# EAGLE schematic main (EAGLE 6.5.0)
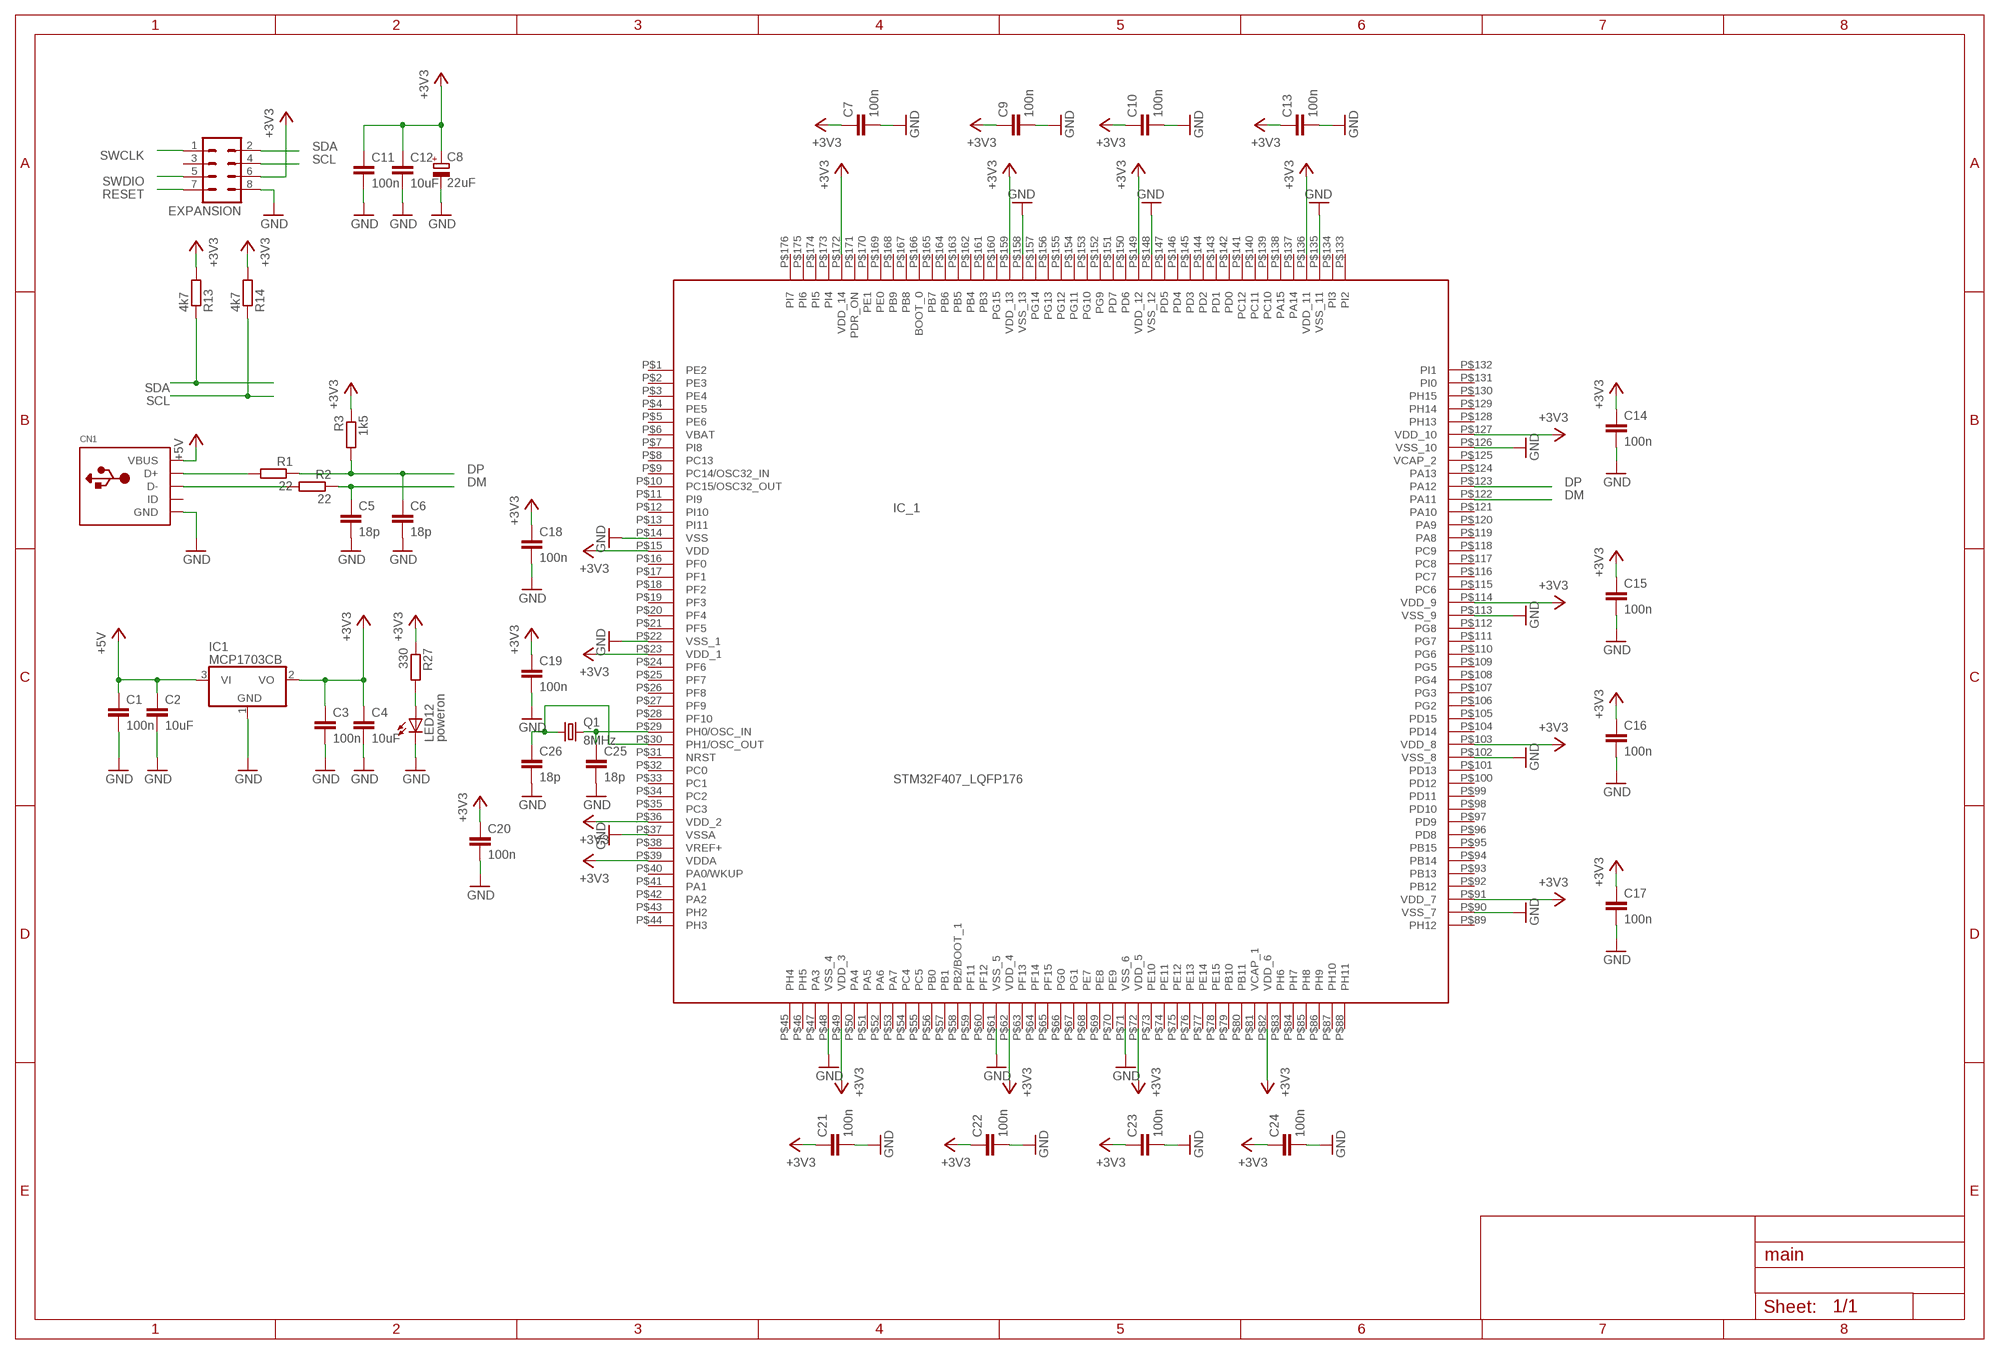
[diagram p0: schematic, sheet 1]

## Parts
C1  100n  C-EUC0805  [C0805]
C2  10uF  C-EUC0805  [C0805]
C3  100n  C-EUC0805  [C0805]
C4  10uF  C-EUC0805  [C0805]
C5  18p  C-EUC0805  [C0805]
C6  18p  C-EUC0805  [C0805]
C7  100n  C-EUC0805  [C0805]
C8  22uF  CPOL-EU153CLV-0505  [153CLV-0505]
C9  100n  C-EUC0805  [C0805]
C10  100n  C-EUC0805  [C0805]
C11  100n  C-EUC0805  [C0805]
C12  10uF  C-EUC0805  [C0805]
C13  100n  C-EUC0805  [C0805]
C14  100n  C-EUC0805  [C0805]
C15  100n  C-EUC0805  [C0805]
C16  100n  C-EUC0805  [C0805]
C17  100n  C-EUC0805  [C0805]
C18  100n  C-EUC0805  [C0805]
C19  100n  C-EUC0805  [C0805]
C20  100n  C-EUC0805  [C0805]
C21  100n  C-EUC0805  [C0805]
C22  100n  C-EUC0805  [C0805]
C23  100n  C-EUC0805  [C0805]
C24  100n  C-EUC0805  [C0805]
C25  18p  C-EUC0805  [C0805]
C26  18p  C-EUC0805  [C0805]
CN1  USBMINIB  [USB-MINIB]
EXPANSION  MA04-2  [MA04-2]
IC1  MCP1703CB  [SOT23]
IC_1  STM32F407_LQFP176  [STM32F407_LQFP176]
LED12  poweron  LEDCHIPLED_1206  [CHIPLED_1206]
Q1  8MHz  CRYSTALCTS406  [CTS406]
R1  22  R-EU_M0805  [M0805]
R2  22  R-EU_M0805  [M0805]
R3  1k5  R-EU_M0805  [M0805]
R13  4k7  R-EU_M0805  [M0805]
R14  4k7  R-EU_M0805  [M0805]
R27  330  R-EU_M0805  [M0805]

## Nets
+3V3: C3.1 C4.1 C7.1 C8.+ C9.1 C10.1 C11.1 C12.1 C13.1 C14.1 C15.1 C16.1 C17.1 C18.1 C19.1 C20.1 C21.1 C22.1 C23.1 C24.1 EXPANSION.6 IC1.2(VO) IC_1.P$15(VDD) IC_1.P$23(VDD_1) IC_1.P$36(VDD_2) IC_1.P$39(VDDA) IC_1.P$49(VDD_3) IC_1.P$62(VDD_4) IC_1.P$72(VDD_5) IC_1.P$82(VDD_6) IC_1.P$91(VDD_7) IC_1.P$103(VDD_8) IC_1.P$114(VDD_9) IC_1.P$127(VDD_10) IC_1.P$136(VDD_11) IC_1.P$149(VDD_12) IC_1.P$159(VDD_13) IC_1.P$172(VDD_14) R3.1 R13.2 R14.2 R27.1
+5V: C1.1 C2.1 CN1.VBUS IC1.3(VI)
DM: C5.1 IC_1.P$122(PA11) R2.1
DP: C6.1 IC_1.P$123(PA12) R1.1 R3.2
GND: C1.2 C2.2 C3.2 C4.2 C5.2 C6.2 C7.2 C8.- C9.2 C10.2 C11.2 C12.2 C13.2 C14.2 C15.2 C16.2 C17.2 C18.2 C19.2 C20.2 C21.2 C22.2 C23.2 C24.2 C25.2 C26.2 CN1.GND EXPANSION.8 IC1.1(GND) IC_1.P$14(VSS) IC_1.P$22(VSS_1) IC_1.P$37(VSSA) IC_1.P$48(VSS_4) IC_1.P$61(VSS_5) IC_1.P$71(VSS_6) IC_1.P$90(VSS_7) IC_1.P$102(VSS_8) IC_1.P$113(VSS_9) IC_1.P$126(VSS_10) IC_1.P$135(VSS_11) IC_1.P$148(VSS_12) IC_1.P$158(VSS_13) LED12.C
N$1: CN1.D+ R1.2
N$2: CN1.D- R2.2
N$3: C25.1 IC_1.P$29(PH0/OSC_IN) Q1.3
N$4: C26.1 IC_1.P$30(PH1/OSC_OUT) Q1.1
N$23: LED12.A R27.2
RESET: EXPANSION.7
SCL: EXPANSION.4 R14.1
SDA: EXPANSION.2 R13.1
SWCLK: EXPANSION.1
SWDIO: EXPANSION.5
Unconnected: CN1.ID EXPANSION.3 IC_1.P$1(PE2) IC_1.P$2(PE3) IC_1.P$3(PE4) IC_1.P$4(PE5) IC_1.P$5(PE6) IC_1.P$7(PI8) IC_1.P$8(PC13) IC_1.P$9(PC14/OSC32_IN) IC_1.P$10(PC15/OSC32_OUT) IC_1.P$11(PI9) IC_1.P$12(PI10) IC_1.P$13(PI11) IC_1.P$16(PF0) IC_1.P$17(PF1) IC_1.P$18(PF2) IC_1.P$19(PF3) IC_1.P$20(PF4) IC_1.P$21(PF5) IC_1.P$24(PF6) IC_1.P$25(PF7) IC_1.P$26(PF8) IC_1.P$27(PF9) IC_1.P$28(PF10) IC_1.P$31(NRST) IC_1.P$32(PC0) IC_1.P$33(PC1) IC_1.P$34(PC2) IC_1.P$35(PC3) IC_1.P$40(PA0/WKUP) IC_1.P$41(PA1) IC_1.P$42(PA2) IC_1.P$43(PH2) IC_1.P$44(PH3) IC_1.P$45(PH4) IC_1.P$46(PH5) IC_1.P$47(PA3) IC_1.P$50(PA4) IC_1.P$51(PA5) IC_1.P$52(PA6) IC_1.P$53(PA7) IC_1.P$54(PC4) IC_1.P$55(PC5) IC_1.P$56(PB0) IC_1.P$57(PB1) IC_1.P$58(PB2/BOOT_1) IC_1.P$59(PF11) IC_1.P$60(PF12) IC_1.P$63(PF13) IC_1.P$64(PF14) IC_1.P$65(PF15) IC_1.P$66(PG0) IC_1.P$67(PG1) IC_1.P$68(PE7) IC_1.P$69(PE8) IC_1.P$70(PE9) IC_1.P$73(PE10) IC_1.P$74(PE11) IC_1.P$75(PE12) IC_1.P$76(PE13) IC_1.P$77(PE14) IC_1.P$78(PE15) IC_1.P$79(PB10) IC_1.P$80(PB11) IC_1.P$83(PH6) IC_1.P$84(PH7) IC_1.P$85(PH8) IC_1.P$86(PH9) IC_1.P$87(PH10) IC_1.P$88(PH11) IC_1.P$89(PH12) IC_1.P$92(PB12) IC_1.P$93(PB13) IC_1.P$94(PB14) IC_1.P$95(PB15) IC_1.P$96(PD8) IC_1.P$97(PD9) IC_1.P$98(PD10) IC_1.P$99(PD11) IC_1.P$100(PD12) IC_1.P$101(PD13) IC_1.P$104(PD14) IC_1.P$105(PD15) IC_1.P$106(PG2) IC_1.P$107(PG3) IC_1.P$108(PG4) IC_1.P$109(PG5) IC_1.P$110(PG6) IC_1.P$111(PG7) IC_1.P$112(PG8) IC_1.P$115(PC6) IC_1.P$116(PC7) IC_1.P$117(PC8) IC_1.P$118(PC9) IC_1.P$119(PA8) IC_1.P$120(PA9) IC_1.P$121(PA10) IC_1.P$124(PA13) IC_1.P$128(PH13) IC_1.P$129(PH14) IC_1.P$130(PH15) IC_1.P$131(PI0) IC_1.P$132(PI1) IC_1.P$133(PI2) IC_1.P$134(PI3) IC_1.P$137(PA14) IC_1.P$138(PA15) IC_1.P$139(PC10) IC_1.P$140(PC11) IC_1.P$141(PC12) IC_1.P$142(PD0) IC_1.P$143(PD1) IC_1.P$144(PD2) IC_1.P$145(PD3) IC_1.P$146(PD4) IC_1.P$147(PD5) IC_1.P$150(PD6) IC_1.P$151(PD7) IC_1.P$152(PG9) IC_1.P$153(PG10) IC_1.P$154(PG11) IC_1.P$155(PG12) IC_1.P$156(PG13) IC_1.P$157(PG14) IC_1.P$160(PG15) IC_1.P$161(PB3) IC_1.P$162(PB4) IC_1.P$163(PB5) IC_1.P$164(PB6) IC_1.P$165(PB7) IC_1.P$166(BOOT_0) IC_1.P$167(PB8) IC_1.P$168(PB9) IC_1.P$169(PE0) IC_1.P$170(PE1) IC_1.P$171(PDR_ON) IC_1.P$173(PI4) IC_1.P$174(PI5) IC_1.P$175(PI6) IC_1.P$176(PI7)

## Power pins joined to a net without a drawn wire
VBAT: IC_1.P$6(VBAT)
VCAP_1: IC_1.P$81(VCAP_1)
VCAP_2: IC_1.P$125(VCAP_2)
VREF+: IC_1.P$38(VREF+)

## Library data of the parts
C1-C7 C9-C26 = resistor:C-EU: CAPACITOR, European symbol
C8 = resistor:CPOL-EU: POLARIZED CAPACITOR, European symbol
CN1 = adafruit:USB: USB Connectors USBMINIB - Surface Mount Female Mini-B USB Connector 4UConnector: 06564 By microbuilder.eu Thru-hole RA Female Mini-B USB Connector 4UConnector: 18732 By ladyada.net
EXPANSION = con-lstb:MA04-2: PIN HEADER; OC_FARNELL: unknown; OC_NEWARK: unknown
IC1 = linear:MCP1703: 250 mA, 16V, Low Quiescent Current LDO Regulator Source: http://ww1.microchip.com/downloads/en/DeviceDoc/22049b.pdf
IC_1 = my_parts:STM32F407_LQFP176: STM32F407 in LQFP176 Package, 176 Pin Microcontroller (MCU) ARM Cortex M4 1024kB FLASH 168 Mhz 192kB SRAM
LED12 = led:LED: LED OSRAM: - CHIPLED LG R971, LG N971, LY N971, LG Q971, LY Q971, LO R971, LY R971 LH N974, LH R974 LS Q976, LO Q976, LY Q976 LO Q996 - Hyper CHIPLED LW Q18S LB Q993, LB Q99A, LB R99A - SideLED LS A670, LO A670, LY A670, LG A670, LP A670 LB A673, LV A673, LT A673, LW A673 LH A674 LY A675 LS A676, LA A676, LO A676, LY A676, LW A676 LS A679, LY A679, LG A679 - Hyper Micro SIDELED® LS Y876, LA Y876, LO Y876, LY Y876 LT Y87S - SmartLED LW L88C, LW L88S LB L89C, LB L89S, LG L890 LS L89K, LO L89K, LY L89K LS L896, LA L896, LO L896, LY L896 - TOPLED LS T670, LO T670, LY T670, LG T670, LP T670 LSG T670, LSP T670, LSY T670, LOP T670, LYG T670 LG T671, LOG T671, LSG T671 LB T673, LV T673, LT T673, LW T673 LH T674 LS T676, LA T676, LO T676, LY T676, LB T676, LH T676, LSB T676, LW T676 LB T67C, LV T67C, LT T67C, LS T67K, LO T67K, LY T67K, LW E67C LS E67B, LA E67B, LO E67B, LY E67B, LB E67C, LV E67C, LT E67C LW T67C LS T679, LY T679, LG T679 LS T770, LO T770, LY T770, LG T770, LP T770 LB T773, LV T773, LT T773, LW T773 LH T774 LS E675, LA E675, LY E675, LS T675 LS T776, LA T776, LO T776, LY T776, LB T776 LHGB T686 LT T68C, LB T68C - Hyper Mini TOPLED® LB M676 - Mini TOPLED Santana® LG M470 LS M47K, LO M47K, LY M47K Source: http://www.osram.convergy.de LUXEON: - LUMILED® LXK2-PW12-R00, LXK2-PW12-S00, LXK2-PW14-U00, LXK2-PW14-V00 LXK2-PM12-R00, LXK2-PM12-S00, LXK2-PM14-U00 LXK2-PE12-Q00, LXK2-PE12-R00, LXK2-PE12-S00, LXK2-PE14-T00, LXK2-PE14-U00 LXK2-PB12-K00, LXK2-PB12-L00, LXK2-PB12-M00, LXK2-PB14-N00, LXK2-PB14-P00, LXK2-PB14-Q00 LXK2-PR12-L00, LXK2-PR12-M00, LXK2-PR14-Q00, LXK2-PR14-R00 LXK2-PD12-Q00, LXK2-PD12-R00, LXK2-PD12-S00 LXK2-PH12-R00, LXK2-PH12-S00 LXK2-PL12-P00, LXK2-PL12-Q00, LXK2-PL12-R00 Source: www.luxeon.com KINGBRIGHT: KA-3528ASYC Source: www.kingbright.com
Q1 = crystal:CRYSTAL: CRYSTAL; OC_FARNELL: unknown; OC_NEWARK: unknown
R1-R3 R13 R14 R27 = resistor:R-EU_: RESISTOR, European symbol